# Altium schematic sheet FPGA.SCHDOC
size B
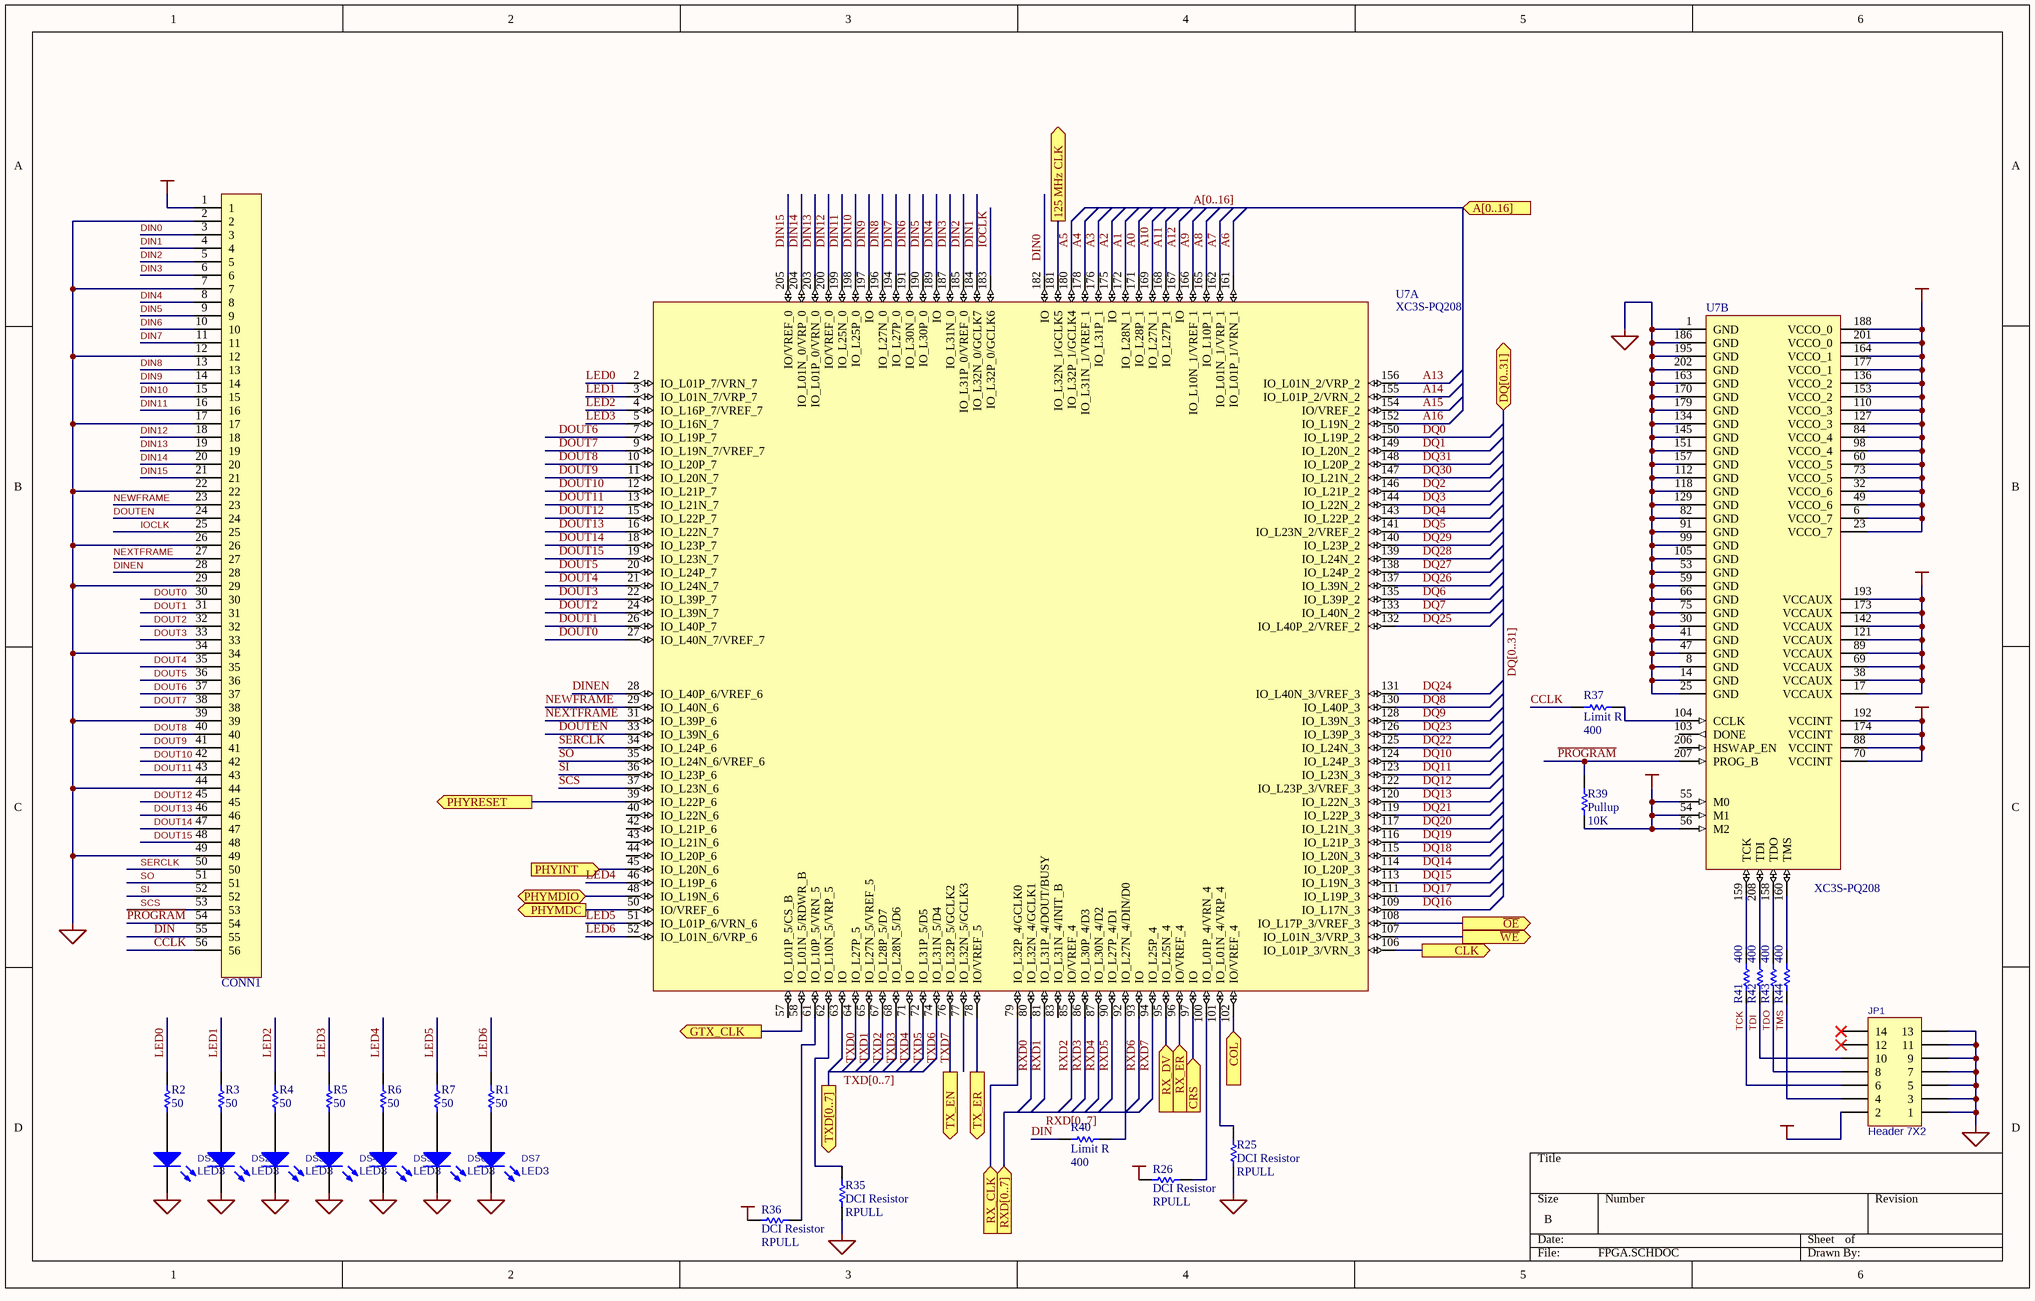
[diagram p0: FPGA.SCHDOC]

## Parts
CONN1  CON56B  [HDR56F]  (value not drawn)
DS1  LED3  [SMD _LED]
DS2  LED3  [SMD _LED]
DS3  LED3  [SMD _LED]
DS4  LED3  [SMD _LED]
DS5  LED3  [SMD _LED]
DS6  LED3  [SMD _LED]
DS7  LED3  [SMD _LED]
JP1  Header 7X2  [HDR2x7-2mm]
R1  value 50  [0603]  (hidden comment: RESISTOR)
R2  value 50  [0603]  (hidden comment: RESISTOR)
R3  value 50  [0603]  (hidden comment: RESISTOR)
R4  value 50  [0603]  (hidden comment: RESISTOR)
R5  value 50  [0603]  (hidden comment: RESISTOR)
R6  value 50  [0603]  (hidden comment: RESISTOR)
R7  value 50  [0603]  (hidden comment: RESISTOR)
R25  DCI Resistor  value RPULL  [0603]
R26  DCI Resistor  value RPULL  [0603]
R35  DCI Resistor  value RPULL  [0603]
R36  DCI Resistor  value RPULL  [0603]
R37  Limit R  value 400  [0603]
R39  Pullup  value 10K  [0603]
R40  Limit R  value 400  [0603]
R41  value 400  [0603]  (hidden comment: RESISTOR)
R42  value 400  [0603]  (hidden comment: RESISTOR)
R43  value 400  [0603]  (hidden comment: RESISTOR)
R44  value 400  [0603]  (hidden comment: RESISTOR)
U7  XC3S-PQ208  [F-QFP28X28-G208/Z32N]  (parts A,B of 2)

## Ports
125 MHz CLK (out), A[0..16] (out), CLK (out), COL (in), CRS (in), DQ[0..31] (bidir), GTX_CLK (out), PHYINT (in), PHYMDC (out), PHYMDIO (bidir), PHYRESET (out), RX_CLK (in), RX_DV (in), RX_ER (in), RXD[0..7] (in), TX_EN (out), TX_ER (out), TXD[0..7] (out), ~{OE} (out), ~{WE} (out)

## Nets
+1.2VCC: U7.70(VCCINT) U7.88(VCCINT) U7.174(VCCINT) U7.192(VCCINT)
+2.5VCC: U7.17(VCCAUX) U7.38(VCCAUX) U7.69(VCCAUX) U7.89(VCCAUX) U7.121(VCCAUX) U7.142(VCCAUX) U7.173(VCCAUX) U7.193(VCCAUX)
GND: CONN1.2 CONN1.7 CONN1.12 CONN1.17 CONN1.22 CONN1.26 CONN1.29 CONN1.34 CONN1.39 CONN1.44 CONN1.49 DS1.2(K) DS2.2(K) DS3.2(K) DS4.2(K) DS5.2(K) DS6.2(K) DS7.2(K) JP1.1 JP1.3 JP1.5 JP1.7 JP1.9 JP1.11 JP1.13 R25.1 R35.1 U7.1(GND) U7.8(GND) U7.14(GND) U7.25(GND) U7.30(GND) U7.41(GND) U7.47(GND) U7.53(GND) U7.59(GND) U7.66(GND) U7.75(GND) U7.82(GND) U7.91(GND) U7.99(GND) U7.105(GND) U7.112(GND) U7.118(GND) U7.129(GND) U7.134(GND) U7.145(GND) U7.151(GND) U7.157(GND) U7.163(GND) U7.170(GND) U7.179(GND) U7.186(GND) U7.195(GND) U7.202(GND)
VCC: CONN1.1 JP1.2 R26.2 R36.2 R39.2 U7.6(VCCO_7) U7.23(VCCO_7) U7.32(VCCO_6) U7.49(VCCO_6) U7.54(M1) U7.55(M0) U7.56(M2) U7.60(VCCO_5) U7.73(VCCO_5) U7.84(VCCO_4) U7.98(VCCO_4) U7.110(VCCO_3) U7.127(VCCO_3) U7.136(VCCO_2) U7.153(VCCO_2) U7.164(VCCO_1) U7.177(VCCO_1) U7.188(VCCO_0) U7.201(VCCO_0)
125 MHz CLK: U7.181(IO_L32N_1/GCLK5) ; port 125 MHz CLK
A0: U7.171(IO_L28P_1)
A1: U7.172(IO_L28N_1)
A2: U7.175(IO)
A3: U7.176(IO_L31P_1)
A4: U7.178(IO_L31N_1/VREF_1)
A5: U7.180(IO_L32P_1/GCLK4)
A6: U7.161(IO_L01P_1/VRN_1)
A7: U7.162(IO_L01N_1/VRP_1)
A8: U7.165(IO_L10P_1)
A9: U7.166(IO_L10N_1/VREF_1)
A10: U7.169(IO_L27N_1)
A11: U7.168(IO_L27P_1)
A12: U7.167(IO)
A13: U7.156(IO_L01N_2/VRP_2)
A14: U7.155(IO_L01P_2/VRN_2)
A15: U7.154(IO/VREF_2)
A16: U7.152(IO_L19N_2)
CCLK: CONN1.56 R37.2
CLK: U7.106(IO_L01P_3/VRN_3) ; port CLK
COL: U7.102(IO/VREF_4) ; port COL
CRS: U7.97(IO) ; port CRS
DIN: CONN1.55 R40.2
DIN0: CONN1.3 U7.182(IO)
DIN1: CONN1.4 U7.184(IO_L32N_0/GCLK7)
DIN2: CONN1.5 U7.185(IO_L31P_0/VREF_0)
DIN3: CONN1.6 U7.187(IO_L31N_0)
DIN4: CONN1.8 U7.189(IO)
DIN5: CONN1.9 U7.190(IO_L30P_0)
DIN6: CONN1.10 U7.191(IO_L30N_0)
DIN7: CONN1.11 U7.194(IO_L27P_0)
DIN8: CONN1.13 U7.196(IO_L27N_0)
DIN9: CONN1.14 U7.197(IO)
DIN10: CONN1.15 U7.198(IO_L25P_0)
DIN11: CONN1.16 U7.199(IO_L25N_0)
DIN12: CONN1.18 U7.200(IO/VREF_0)
DIN13: CONN1.19 U7.203(IO_L01P_0/VRN_0)
DIN14: CONN1.20 U7.204(IO_L01N_0/VRP_0)
DIN15: CONN1.21 U7.205(IO/VREF_0)
DINEN: CONN1.28 U7.28(IO_L40P_6/VREF_6)
DOUT0: CONN1.30 U7.27(IO_L40N_7/VREF_7)
DOUT1: CONN1.31 U7.26(IO_L40P_7)
DOUT2: CONN1.32 U7.24(IO_L39N_7)
DOUT3: CONN1.33 U7.22(IO_L39P_7)
DOUT4: CONN1.35 U7.21(IO_L24N_7)
DOUT5: CONN1.36 U7.20(IO_L24P_7)
DOUT6: CONN1.37 U7.7(IO_L19P_7)
DOUT7: CONN1.38 U7.9(IO_L19N_7/VREF_7)
DOUT8: CONN1.40 U7.10(IO_L20P_7)
DOUT9: CONN1.41 U7.11(IO_L20N_7)
DOUT10: CONN1.42 U7.12(IO_L21P_7)
DOUT11: CONN1.43 U7.13(IO_L21N_7)
DOUT12: CONN1.45 U7.15(IO_L22P_7)
DOUT13: CONN1.46 U7.16(IO_L22N_7)
DOUT14: CONN1.47 U7.18(IO_L23P_7)
DOUT15: CONN1.48 U7.19(IO_L23N_7)
DOUTEN: CONN1.24 U7.33(IO_L39N_6)
DQ0: U7.150(IO_L19P_2)
DQ1: U7.149(IO_L20N_2)
DQ2: U7.146(IO_L21P_2)
DQ3: U7.144(IO_L22N_2)
DQ4: U7.143(IO_L22P_2)
DQ5: U7.141(IO_L23N_2/VREF_2)
DQ6: U7.135(IO_L39P_2)
DQ7: U7.133(IO_L40N_2)
DQ8: U7.130(IO_L40P_3)
DQ9: U7.128(IO_L39N_3)
DQ10: U7.124(IO_L24P_3)
DQ11: U7.123(IO_L23N_3)
DQ12: U7.122(IO_L23P_3/VREF_3)
DQ13: U7.120(IO_L22N_3)
DQ14: U7.114(IO_L20P_3)
DQ15: U7.113(IO_L19N_3)
DQ16: U7.109(IO_L17N_3)
DQ17: U7.111(IO_L19P_3)
DQ18: U7.115(IO_L20N_3)
DQ19: U7.116(IO_L21P_3)
DQ20: U7.117(IO_L21N_3)
DQ21: U7.119(IO_L22P_3)
DQ22: U7.125(IO_L24N_3)
DQ23: U7.126(IO_L39P_3)
DQ24: U7.131(IO_L40N_3/VREF_3)
DQ25: U7.132(IO_L40P_2/VREF_2)
DQ26: U7.137(IO_L39N_2)
DQ27: U7.138(IO_L24P_2)
DQ28: U7.139(IO_L24N_2)
DQ29: U7.140(IO_L23P_2)
DQ30: U7.147(IO_L21N_2)
DQ31: U7.148(IO_L20P_2)
GTX_CLK: U7.58(IO_L01N_5/RDWR_B) ; port GTX_CLK
IOCLK: CONN1.25 U7.183(IO_L32P_0/GCLK6)
LED0: R2.2 U7.2(IO_L01P_7/VRN_7)
LED1: R3.2 U7.3(IO_L01N_7/VRP_7)
LED2: R4.2 U7.4(IO_L16P_7/VREF_7)
LED3: R5.2 U7.5(IO_L16N_7)
LED4: R6.2 U7.46(IO_L19P_6)
LED5: R7.2 U7.51(IO_L01P_6/VRN_6)
LED6: R1.2 U7.52(IO_L01N_6/VRP_6)
NEWFRAME: CONN1.23 U7.29(IO_L40N_6)
NEXTFRAME: CONN1.27 U7.31(IO_L39P_6)
~{OE}: U7.108(IO_L17P_3/VREF_3) ; port ~{OE}
~{PROGRAM}: CONN1.54 R39.1 U7.207(PROG_B)
PHYINT: U7.45(IO_L20N_6) ; port PHYINT
PHYMDC: U7.50(IO/VREF_6) ; port PHYMDC
PHYMDIO: U7.48(IO_L19N_6) ; port PHYMDIO
PHYRESET: U7.39(IO_L22P_6) ; port PHYRESET
RX_CLK: U7.79(IO_L32P_4/GCLK0) ; port RX_CLK
RX_DV: U7.95(IO_L25N_4) ; port RX_DV
RX_ER: U7.96(IO/VREF_4) ; port RX_ER
RXD0: U7.80(IO_L32N_4/GCLK1)
RXD1: U7.81(IO_L31P_4/DOUT/BUSY)
RXD2: U7.85(IO/VREF_4)
RXD3: U7.86(IO_L30P_4/D3)
RXD4: U7.87(IO_L30N_4/D2)
RXD5: U7.90(IO_L27P_4/D1)
RXD6: U7.93(IO)
RXD7: U7.94(IO_L25P_4)
SCS: CONN1.53 U7.37(IO_L23N_6)
SERCLK: CONN1.50 U7.34(IO_L24P_6)
SI: CONN1.52 U7.36(IO_L23P_6)
SO: CONN1.51 U7.35(IO_L24N_6/VREF_6)
TCK: JP1.6 R41.2
TDI: JP1.10 R42.2
TDO: JP1.8 R43.2
TMS: JP1.4 R44.2
TX_EN: U7.76(IO_L32P_5/GCLK2) ; port TX_EN
TX_ER: U7.78(IO/VREF_5) ; port TX_ER
TXD0: U7.63(IO)
TXD1: U7.64(IO_L27P_5)
TXD2: U7.65(IO_L27N_5/VREF_5)
TXD3: U7.67(IO_L28P_5/D7)
TXD4: U7.68(IO_L28N_5/D6)
TXD5: U7.71(IO)
TXD6: U7.72(IO_L31P_5/D5)
TXD7: U7.74(IO_L31N_5/D4)
~{WE}: U7.107(IO_L01N_3/VRP_3) ; port ~{WE}
NetDS1_1: DS1.1(A) R2.1
NetDS2_1: DS2.1(A) R3.1
NetDS3_1: DS3.1(A) R4.1
NetDS4_1: DS4.1(A) R5.1
NetDS5_1: DS5.1(A) R6.1
NetDS6_1: DS6.1(A) R7.1
NetDS7_1: DS7.1(A) R1.1
NetR25_2: R25.2 U7.101(IO_L01N_4/VRP_4)
NetR26_1: R26.1 U7.100(IO_L01P_4/VRN_4)
NetR35_2: R35.2 U7.62(IO_L10N_5/VRP_5)
NetR36_1: R36.1 U7.61(IO_L10P_5/VRN_5)
NetR37_1: R37.1 U7.104(CCLK)
NetR40_1: R40.1 U7.92(IO_L27N_4/DIN/D0)
NetR41_1: R41.1 U7.159(TCK)
NetR42_1: R42.1 U7.208(TDI)
NetR43_1: R43.1 U7.158(TDO)
NetR44_1: R44.1 U7.160(TMS)

Not connected (* = marked no-connect by the designer): JP1 12* 14*; U7 40(IO_L22N_6) 42(IO_L21P_6) 43(IO_L21N_6) 44(IO_L20P_6) 57(IO_L01P_5/CS_B) 77(IO_L32N_5/GCLK3) 83(IO_L31N_4/INIT_B) 103(DONE) 206(HSWAP_EN)

## Buses and harness runs
bus A[0..16] = port A[0..16]
bus DQ[0..31] = port DQ[0..31]
bus RXD[0..7] = port RXD[0..7]
bus TXD[0..7] = port TXD[0..7]

## Library data of the parts
DS1-DS7 = LED3: Typical BLUE SiC LED; Published: 8-Jun-2000; LatestRevisionDate: 17-Dec-2003; LatestRevisionNote: PCB Footprint replaced.; Publisher: Altium Limited
JP1 = Header 7X2: Header, 7-Pin, Dual row; Manufacturer: Generic Components; Class I: Connector; Revision: July-2002: Re-released for DXP Platform.; Publisher: Altium Limited
R1-R7 R37 R40-R44 = RESISTOR: Standard Passive Resistor
R25 R26 R35 R36 R39 = Res1: Resistor; Manufacturer: Generic Components; Class I: Passive; Published: 8-Jun-2000; Revision: July-2002: Re-released for DXP Platform.; Publisher: Altium Limited; Class II: Resistor
U7 = XC3S-PQ208: Xilinx Spartan-3 PQ208